# EAGLE design Custom Board 2 (EAGLE 6.5.0)
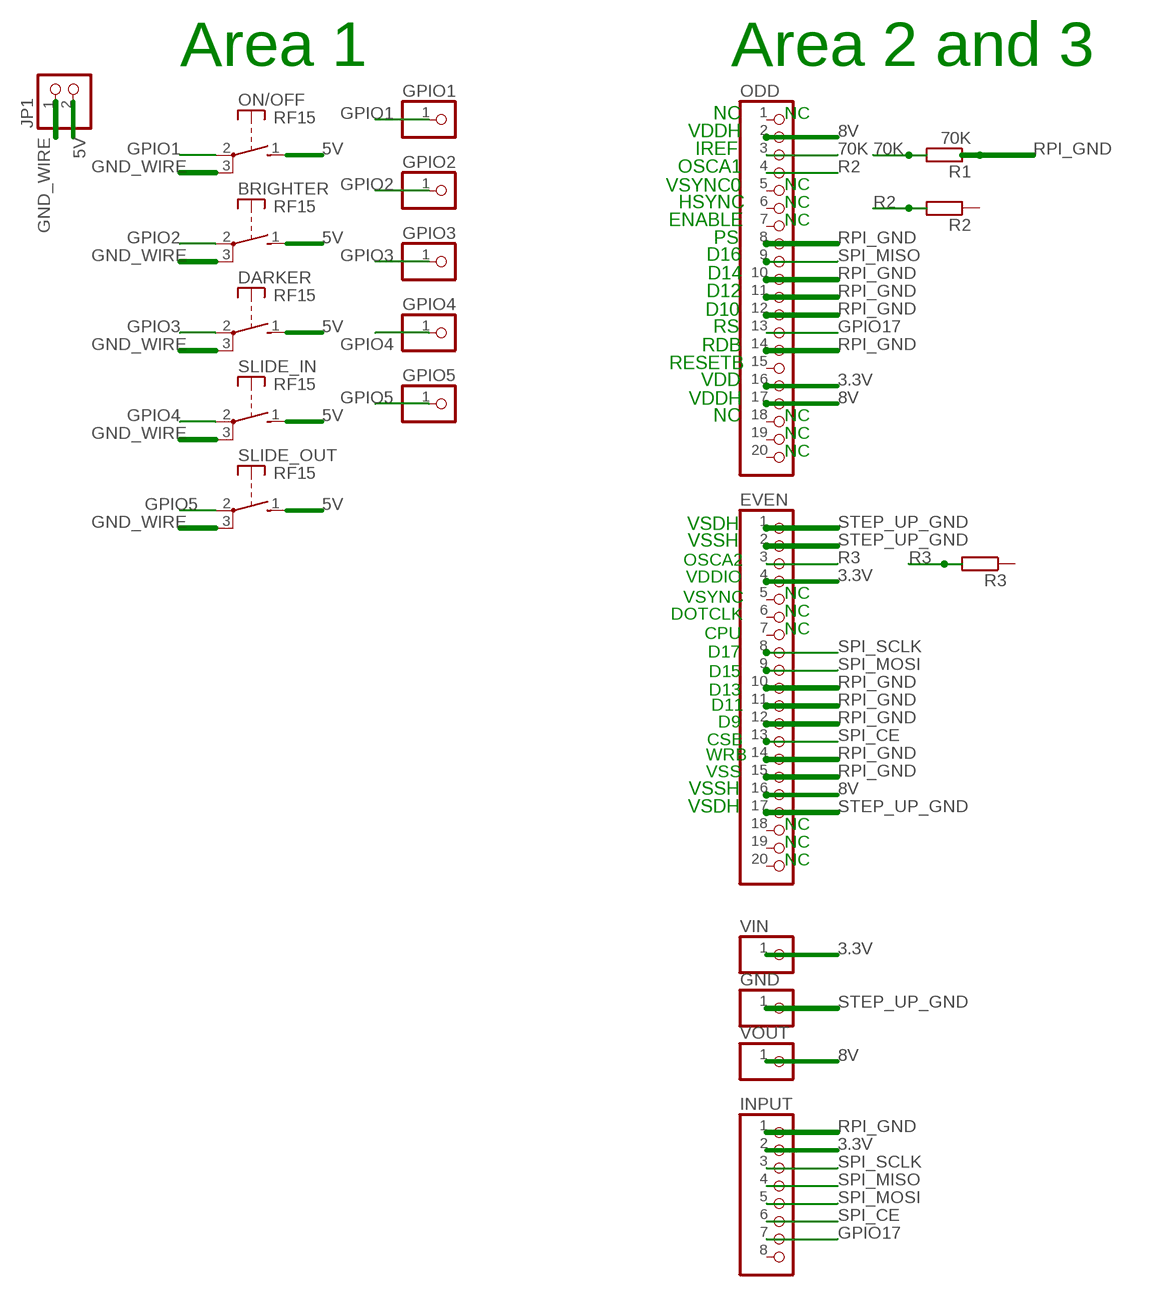
[diagram p0: schematic, sheet 1]

## Parts
BRIGHTER  RF15  [RF15]
DARKER  RF15  [RF15]
EVEN  PINHD-1X20  [1X20]
GND  PINHD-1X1  [1X01]
GPIO1  PINHD-1X1  [1X01]
GPIO2  PINHD-1X1  [1X01]
GPIO3  PINHD-1X1  [1X01]
GPIO4  PINHD-1X1  [1X01]
GPIO5  PINHD-1X1  [1X01]
INPUT  PINHD-1X8  [1X08]
JP1  PINHD-1X2  [1X02]
ODD  PINHD-1X20  [1X20]
ON/OFF  RF15  [RF15]
R1  70K  R-EU_0204/7  [0204/7]
R2  R-EU_0204/7  [0204/7]
R3  R-EU_0204/7  [0204/7]
SLIDE_IN  RF15  [RF15]
SLIDE_OUT  RF15  [RF15]
VIN  PINHD-1X1  [1X01]
VOUT  PINHD-1X1  [1X01]

## Nets
3.3V [POWER]: EVEN.4 INPUT.2 ODD.16 VIN.1
5V [POWER]: BRIGHTER.1(S) DARKER.1(S) JP1.2 ON/OFF.1(S) SLIDE_IN.1(S) SLIDE_OUT.1(S)
8V [POWER]: EVEN.16 ODD.2 ODD.17 VOUT.1
70K: ODD.3 R1.2
GND_WIRE [GND]: BRIGHTER.3(P) DARKER.3(P) JP1.1 ON/OFF.3(P) SLIDE_IN.3(P) SLIDE_OUT.3(P)
GPIO1: GPIO1.1 ON/OFF.2(P)
GPIO2: BRIGHTER.2(P) GPIO2.1
GPIO3: DARKER.2(P) GPIO3.1
GPIO4: GPIO4.1 SLIDE_IN.2(P)
GPIO5: GPIO5.1 SLIDE_OUT.2(P)
GPIO17: INPUT.7 ODD.13
R2: ODD.4 R2.2
R3: EVEN.3 R3.2
RPI_GND [GND]: EVEN.10 EVEN.11 EVEN.12 EVEN.14 EVEN.15 INPUT.1 ODD.8 ODD.10 ODD.11 ODD.12 ODD.14 R1.1
SPI_CE: EVEN.13 INPUT.6
SPI_MISO: INPUT.4 ODD.9
SPI_MOSI: EVEN.9 INPUT.5
SPI_SCLK: EVEN.8 INPUT.3
STEP_UP_GND [GND]: EVEN.1 EVEN.2 EVEN.17 GND.1
Unconnected: EVEN.5 EVEN.6 EVEN.7 EVEN.18 EVEN.19 EVEN.20 INPUT.8 ODD.1 ODD.5 ODD.6 ODD.7 ODD.15 ODD.18 ODD.19 ODD.20 R2.1 R3.1

## Notes on the sheet
- Area 1 | Area 2 and 3
- NC | NC
- VDDH
- IREF
- OSCA1
- VSYNC0 | NC
- HSYNC | NC
- ENABLE | NC
- PS
- D16
- D14
- D12
- D10
- RS
- RDB
- RESETB
- VDD
- VDDH
- NC | NC
- NC
- NC
- VSDH
- VSSH
- OSCA2
- VDDIO
- VSYNC | NC
- DOTCLK | NC
- CPU | NC
- D17
- D15
- D13
- D11
- D9
- CSB
- WRB
- VSS
- VSSH
- VSDH
- NC
- NC
- NC

## Library data of the parts
BRIGHTER DARKER ON/OFF SLIDE_IN SLIDE_OUT = switch-misc:RF15: RAFI SWITCH
EVEN ODD = pinhead:PINHD-1X20: PIN HEADER
GND GPIO1-GPIO5 VIN VOUT = pinhead:PINHD-1X1: PIN HEADER
INPUT = pinhead:PINHD-1X8: PIN HEADER
JP1 = pinhead:PINHD-1X2: PIN HEADER
R1-R3 = resistor:R-EU_: RESISTOR, European symbol

## Net classes
1 GND: width 0.813 mm
2 POWER: width 0.61 mm

## Board
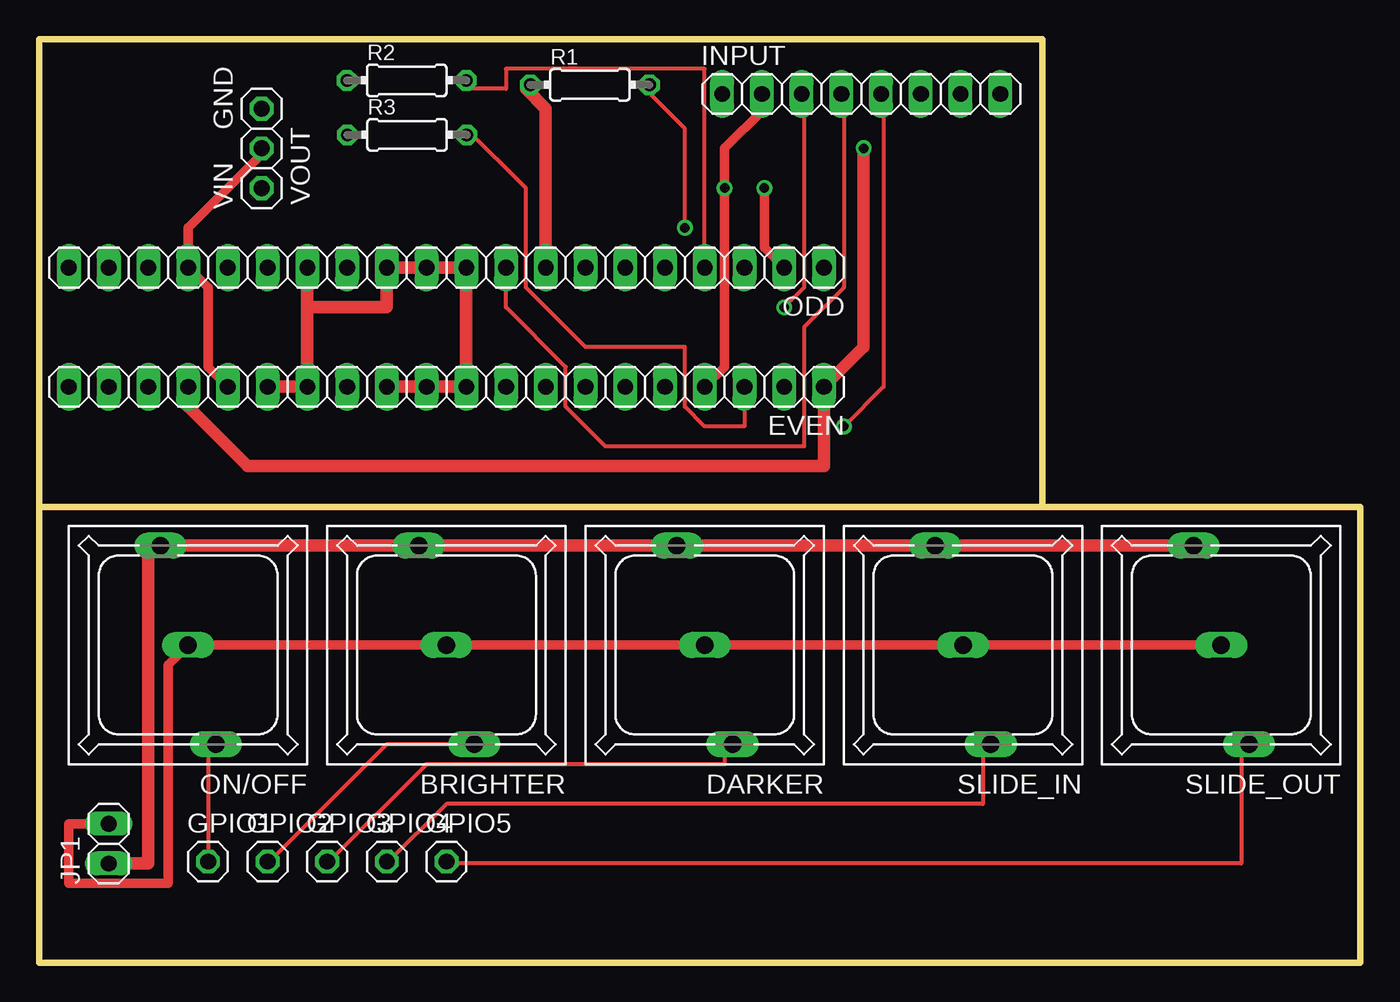
[diagram p1: board, top side]
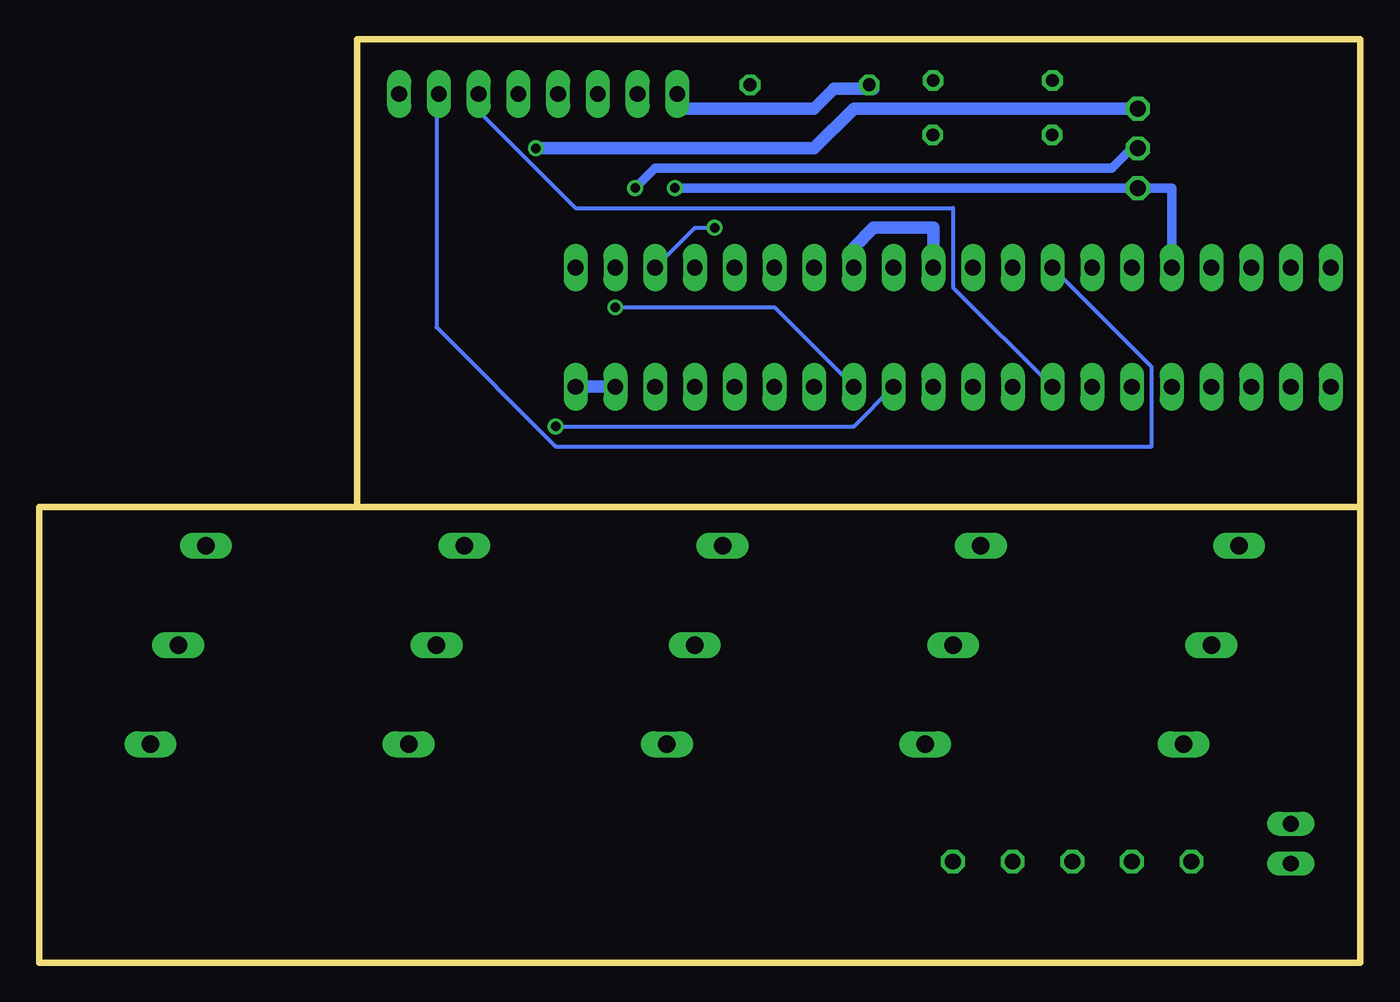
[diagram p2: board, bottom side, seen from below]

Size 84.45 x 59.05 mm. Coordinates in mm from the lower left corner, seen from the top.
Outline: 0,29.21 0,59.05 64.14,59.05 64.14,29.21
Outline: 0,0 84.45,0 84.45,29.16 0,29.16 0,0
Copper layers (1*16): Top 0.035mm / dielectric 1.5mm / Bottom 0.035mm
Design rules "default": minimum track width 10mil, minimum drill 24mil, track to track 8mil, track to pad 8mil, pad to pad 8mil, via to via 8mil, smd to smd 8mil, copper to edge 40mil, drill to drill 8mil, minimum pad ring 10mil, minimum via ring 8mil, stop-mask expansion 4mil, vias tented up to drill 0mil, thermal gap 10mil

### Footprints (pad centres in the part's own frame; a part is rotated, then mirrored left to right if it is on the bottom)
RF15 = drill 1.118 long: 1 0,0; 2 -1.778,6.35; 3 1.778,-6.35
1X20 = drill 1.016 long: 1 -24.13,0; 2 -21.59,0; 3 -19.05,0; 4 -16.51,0; 5 -13.97,0; 6 -11.43,0; 7 -8.89,0; 8 -6.35,0; 9 -3.81,0; 10 -1.27,0; 11 1.27,0; 12 3.81,0; 13 6.35,0; 14 8.89,0; 15 11.43,0; 16 13.97,0; 17 16.51,0; 18 19.05,0; 19 21.59,0; 20 24.13,0
1X01 = drill 1.016 octagon: 1 0,0
1X08 = drill 1.016 long: 1 -8.89,0; 2 -6.35,0; 3 -3.81,0; 4 -1.27,0; 5 1.27,0; 6 3.81,0; 7 6.35,0; 8 8.89,0
1X02 = drill 1.016 long: 1 -1.27,0; 2 1.27,0
0204/7 = drill 0.813 octagon: 1 -3.81,0; 2 3.81,0

### Placement (x,y rotation side)
BRIGHTER  26.04,20.32 180 top
DARKER  42.54,20.32 180 top
EVEN  26.04,36.83 180 top
GND  14.22,54.61 90 top
GPIO1  10.79,6.48 0 top
GPIO2  14.61,6.48 0 top
GPIO3  18.42,6.48 0 top
GPIO4  22.23,6.48 0 top
GPIO5  26.04,6.48 0 top
INPUT  52.55,55.55 0 top
JP1  4.45,7.62 90 top
ODD  26.04,44.45 180 top
ON/OFF  9.53,20.32 180 top
R1  35.2,56.13 0 top
R2  23.5,56.41 0 top
R3  23.52,52.93 0 top
SLIDE_IN  59.05,20.32 180 top
SLIDE_OUT  75.57,20.32 180 top
VIN  14.22,49.53 90 top
VOUT  14.22,52.07 270 top

### Tracks (layer width: path | path; a pad name or v marks a point on that pad's centre or on a via)
3.3V  (via drill 0.61)
  Top 0.61: EVEN.4 43.81,38.1 v43.81,49.53 43.81,52.07 46.35,54.61 INPUT.2
  Bottom 0.61: ODD.16 12.06,49.53 VIN.1 14.61,49.53 v43.81,49.53
5V
  Top 0.61: JP1.2 1.91,8.89 1.91,5.08 8.26,5.08 8.26,19.05 ON/OFF.1 BRIGHTER.1 DARKER.1 SLIDE_IN.1 SLIDE_OUT.1
8V  (via drill 0.61)
  Top 0.61: EVEN.16 10.79,38.1 10.79,43.18 ODD.17 9.53,46.99 14.61,52.07 VOUT.1 | ODD.2 46.35,45.72 v46.35,49.53
  Bottom 0.61: v46.35,49.53 45.09,50.8 15.88,50.8 14.61,52.07 VOUT.1
70K  (via drill 0.61)
  Top 0.254: v41.27,46.99 41.27,53.34 38.73,55.88 R1.2
  Bottom 0.254: v41.27,46.99 42.54,46.99 ODD.3
GND_WIRE
  Top 0.813: SLIDE_OUT.3 SLIDE_IN.3 DARKER.3 BRIGHTER.3 ON/OFF.3 6.98,26.67 6.98,6.35 JP1.1
GPIO1
  Top 0.254: 10.79,6.35 GPIO1.1 10.79,13.97 ON/OFF.2
GPIO2
  Top 0.254: BRIGHTER.2 22.23,13.97 14.61,6.35 GPIO2.1
GPIO3
  Top 0.254: GPIO3.1 18.42,6.35 24.77,12.7 43.81,12.7 43.81,13.97 DARKER.2
GPIO4
  Top 0.254: GPIO4.1 22.23,6.35 26.04,10.16 60.32,10.16 60.32,13.97 SLIDE_IN.2
GPIO5
  Top 0.254: GPIO5.1 26.04,6.35 76.84,6.35 76.84,13.97 SLIDE_OUT.2
GPIO17
  Bottom 0.254: ODD.13 13.33,38.1 13.33,33.02 51.43,33.02 59.05,40.64 59.05,54.61 INPUT.7
R2
  Top 0.254: ODD.4 42.54,57.15 29.85,57.15 29.85,55.88 27.31,55.88 R2.2
R3
  Top 0.254: EVEN.3 45.09,34.29 42.54,34.29 41.27,35.56 41.27,39.37 34.92,39.37 31.12,43.18 31.12,49.53 27.31,53.34 R3.2
RPI_GND
  Top 0.813: EVEN.15 EVEN.14 17.15,41.91 | 17.15,41.91 ODD.14 | EVEN.12 EVEN.11 EVEN.10 ODD.10 ODD.11 ODD.12 22.23,41.91 17.15,41.91 | ODD.8 32.38,54.61 31.12,55.88 R1.1
  Bottom 0.813: INPUT.1 43.81,54.61 34.92,54.61 33.66,55.88 31.12,55.88 R1.1 | ODD.10 27.31,46.99 31.12,46.99 32.38,45.72 ODD.8
SPI_CE
  Bottom 0.254: EVEN.13 26.04,43.18 26.04,48.26 50.16,48.26 56.52,54.61 INPUT.6
SPI_MISO
  Top 0.254: ODD.9 29.85,41.91 33.66,38.1 33.66,35.56 36.2,33.02 48.89,33.02 48.89,40.64 51.43,43.18 51.43,54.61 INPUT.4
SPI_MOSI  (via drill 0.61)
  Top 0.254: v51.43,34.29 53.98,36.83 53.98,54.61 INPUT.5
  Bottom 0.254: EVEN.9 32.38,34.29 v51.43,34.29
SPI_SCLK  (via drill 0.61)
  Top 0.254: v47.62,41.91 48.89,43.18 48.89,54.61 INPUT.3
  Bottom 0.254: EVEN.8 37.46,41.91 v47.62,41.91
STEP_UP_GND  (via drill 0.61)
  Top 0.813: EVEN.17 9.53,35.56 13.33,31.75 50.16,31.75 EVEN.1 52.7,39.37 v52.7,52.07
  Bottom 0.813: GND.1 32.38,54.61 34.92,52.07 v52.7,52.07 | EVEN.1 EVEN.2